# Altium schematic sheet ShutdownLoop.SchDoc: QUTMS Shutdown V2 - ShutdownLoop
size A4; Organization: QUT Motorsport; Address1: O-120; Address2: O Block; Address3: QUT Gardnes Point; Address4: Brisbane, 4000; DocumentNumber: 2; SheetNumber: 2; SheetTotal: 10
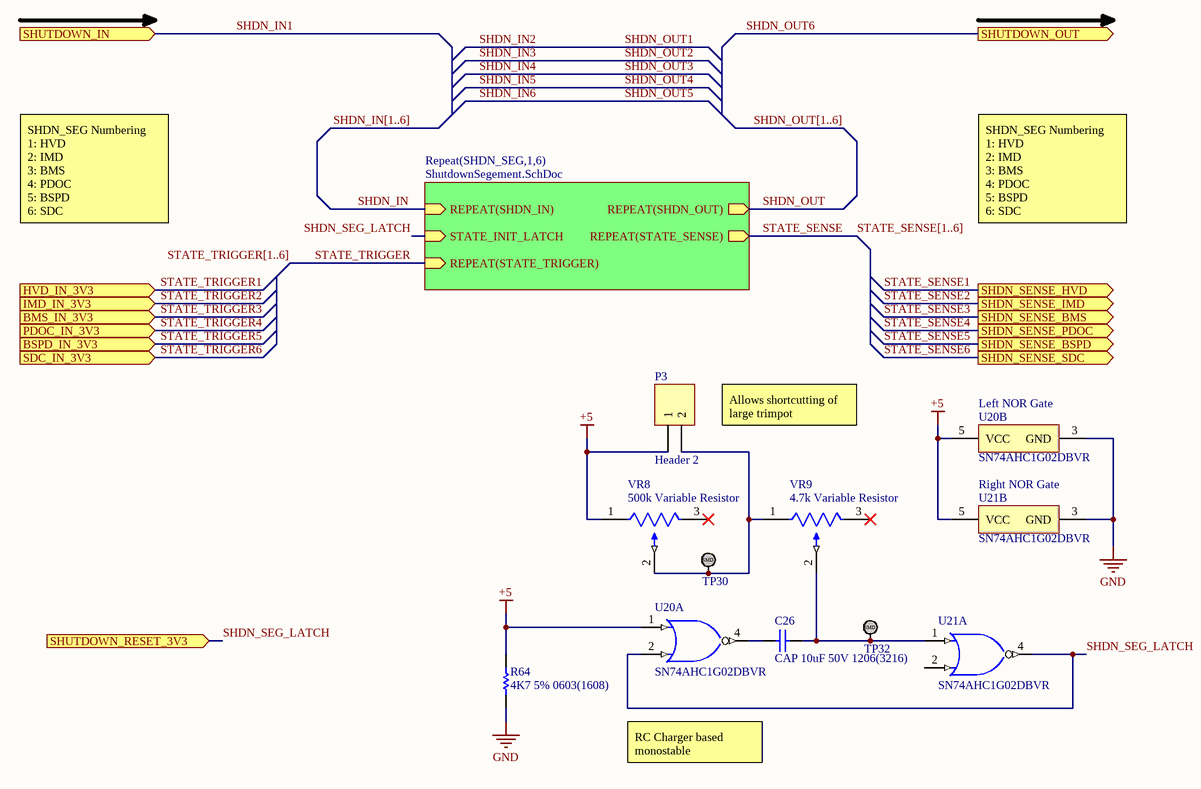
[diagram p0: ShutdownLoop.SchDoc]

## Parts
C26  CAP 10uF 50V 1206(3216)  [CAPC1206(3216)190_M]
P3  Header 2  [HDR1X2]
R64  4K7 5% 0603(1608)  [RESC0603(1608)_N]
TP30  TestPoint_SMD  [TestPointSMD]  (value not drawn)
TP32  TestPoint_SMD  [TestPointSMD]  (value not drawn)
U20  SN74AHC1G02DBVR  [DBV0005A_L]  (parts A,B of 2)
U21  SN74AHC1G02DBVR  [DBV0005A_L]  (parts A,B of 2)
VR8  500k Variable Resistor  [VG039NCHXTB472]
VR9  4.7k Variable Resistor  [VG039NCHXTB472]

## Sub-sheets
Repeat(SHDN_SEG,1,6) = ShutdownSegement.SchDoc: REPEAT(SHDN_OUT) (out), REPEAT(SHDN_IN) (in), STATE_INIT_LATCH (in), REPEAT(STATE_TRIGGER) (in), REPEAT(STATE_SENSE) (out)

## Ports
BMS_IN_3V3 (in), BSPD_IN_3V3 (in), HVD_IN_3V3 (in), IMD_IN_3V3 (in), PDOC_IN_3V3 (in), SDC_IN_3V3 (in), SHDN_SENSE_BMS (out), SHDN_SENSE_BSPD (out), SHDN_SENSE_HVD (out), SHDN_SENSE_IMD (out), SHDN_SENSE_PDOC (out), SHDN_SENSE_SDC (out), SHUTDOWN_IN (in), SHUTDOWN_OUT (out), SHUTDOWN_RESET_3V3 (in)

## Nets
+5: P3.1 R64.2 U20.1(A) U20.5(VCC) U21.5(VCC) VR8.1
GND: R64.1 U20.3(GND) U21.3(GND)
SHDN_IN: sheet Repeat(SHDN_SEG,1,6)/REPEAT(SHDN_IN)
SHDN_IN1: port SHUTDOWN_IN
SHDN_OUT: sheet Repeat(SHDN_SEG,1,6)/REPEAT(SHDN_OUT)
SHDN_OUT6: port SHUTDOWN_OUT
SHDN_SEG_LATCH: U20.2(B) U21.4(Y) ; port SHUTDOWN_RESET_3V3, sheet Repeat(SHDN_SEG,1,6)/STATE_INIT_LATCH
STATE_SENSE: sheet Repeat(SHDN_SEG,1,6)/REPEAT(STATE_SENSE)
STATE_SENSE1: port SHDN_SENSE_HVD
STATE_SENSE2: port SHDN_SENSE_IMD
STATE_SENSE3: port SHDN_SENSE_BMS
STATE_SENSE4: port SHDN_SENSE_PDOC
STATE_SENSE5: port SHDN_SENSE_BSPD
STATE_SENSE6: port SHDN_SENSE_SDC
STATE_TRIGGER: sheet Repeat(SHDN_SEG,1,6)/REPEAT(STATE_TRIGGER)
STATE_TRIGGER1: port HVD_IN_3V3
STATE_TRIGGER2: port IMD_IN_3V3
STATE_TRIGGER3: port BMS_IN_3V3
STATE_TRIGGER4: port PDOC_IN_3V3
STATE_TRIGGER5: port BSPD_IN_3V3
STATE_TRIGGER6: port SDC_IN_3V3
NetC26_1: C26.1 TP32.1 U21.1(A) VR9.2
NetC26_2: C26.2 U20.4(Y)
NetP3_2: P3.2 TP30.1 VR8.2 VR9.1

Not connected (* = marked no-connect by the designer): U21 2(B); VR8 3(49)*; VR9 3(49)*

## Buses and harness runs
bus SHDN_IN[1..6]
bus SHDN_OUT[1..6]
bus STATE_SENSE[1..6]
bus STATE_TRIGGER[1..6]

## Notes on the sheet
- SHDN_SEG Numbering
  1: HVD
  2: IMD
  3: BMS
  4: PDOC
  5: BSPD
  6: SDC
- (near U20) Left NOR Gate
- (near P3) Allows shortcutting of large trimpot
- Right NOR Gate
- RC Charger based monostable
- Title
- Size:
- Date:
- A4
- Number:
- Time:
- Revision:
- Sheet
- of
- File:
- (in symbol TestPoint_SMD) SMD

## Library data of the parts
C26 = CMP-1037-04982-1: CAP 10uF 50V ±10% 1206 (3216 Metric) Thickness 1.9mm SMD; Case-EIA: 1206; Tolerance: Â±10%; Case-Metric: 3216; Technology: SMT; Max Thickness: 1.9 mm; Value: 10uF; Rated Voltage: 50 V
P3 = Header 2: Header, 2-Pin; LatestRevisionDate: 17-Jul-2002; LatestRevisionNote: Re-released for DXP Platform.; Publisher: Altium Limited
R64 = CMP-1012-00090-1: 4K7 0.1W 5% 0603 (1608 Metric)  SMD; Case-Metric: 1608; Value: 4700.00 Ohm; Case-EIA: 0603; Tolerance: 5 %; Technology: SMT; Power: 0.1 W
U20 U21 = CMP-0859-00024-3: Single 2-Input Positive-NOR Gate, DBV0005A, LARGE T&R; Manufacturer: Texas Instruments; Output Drive (IOL/IOH)(Max)(mA): 50/-50; Sub-Family: NAND Gate; Gate Type: NOR; Output Type: CMOS; 3-State Output: No; Voltage(Nom)(V): 3.3,5; tpd @ Nom Voltage(Max)(ns): 11.4,7.5; Bits(#): 1; VCC(Max)(V): 5.5; ICC @ Nom Voltage(Max)(mA): 0.01; VCC(Min)(V): 2; Technology Family: AHC; Rating: Catalog; Logic: True; F @ Nom Voltage(Max)(Mhz): 75; DatasheetVersion: SCLS342M; Input Type: CMOS; Operating Temperature Range(C): -40 to 125,-40 to 85; Generic Part Number: SN74AHC1G02; PackageReference: DBV0005A; Schmitt Trigger: No
VR8 = 500k Variable Resistor: 500K ±25% ±250 ppm/°C SMD Variable Resistors RoHS | VG039NCHXTB504; ComponentLink1Description: LCSC; ComponentLink1URL: https://lcsc.com/product-detail/Variable-Resistors_HDK-Hokuriku-Elec-Industry-VG039NCHXTB504_C128558.html
VR9 = 4.7k Variable Resistor: 4k7 ±25% ±250 ppm/°C SMD Variable Resistors RoHS | VG039NCHXTB472; ComponentLink1Description: LCSC; ComponentLink1URL: https://lcsc.com/product-detail/Variable-Resistors_HDK-Hokuriku-Elec-Industry-VG039NCHXTB472_C128555.html